# Altium schematic sheet CAN.SchDoc
size A4
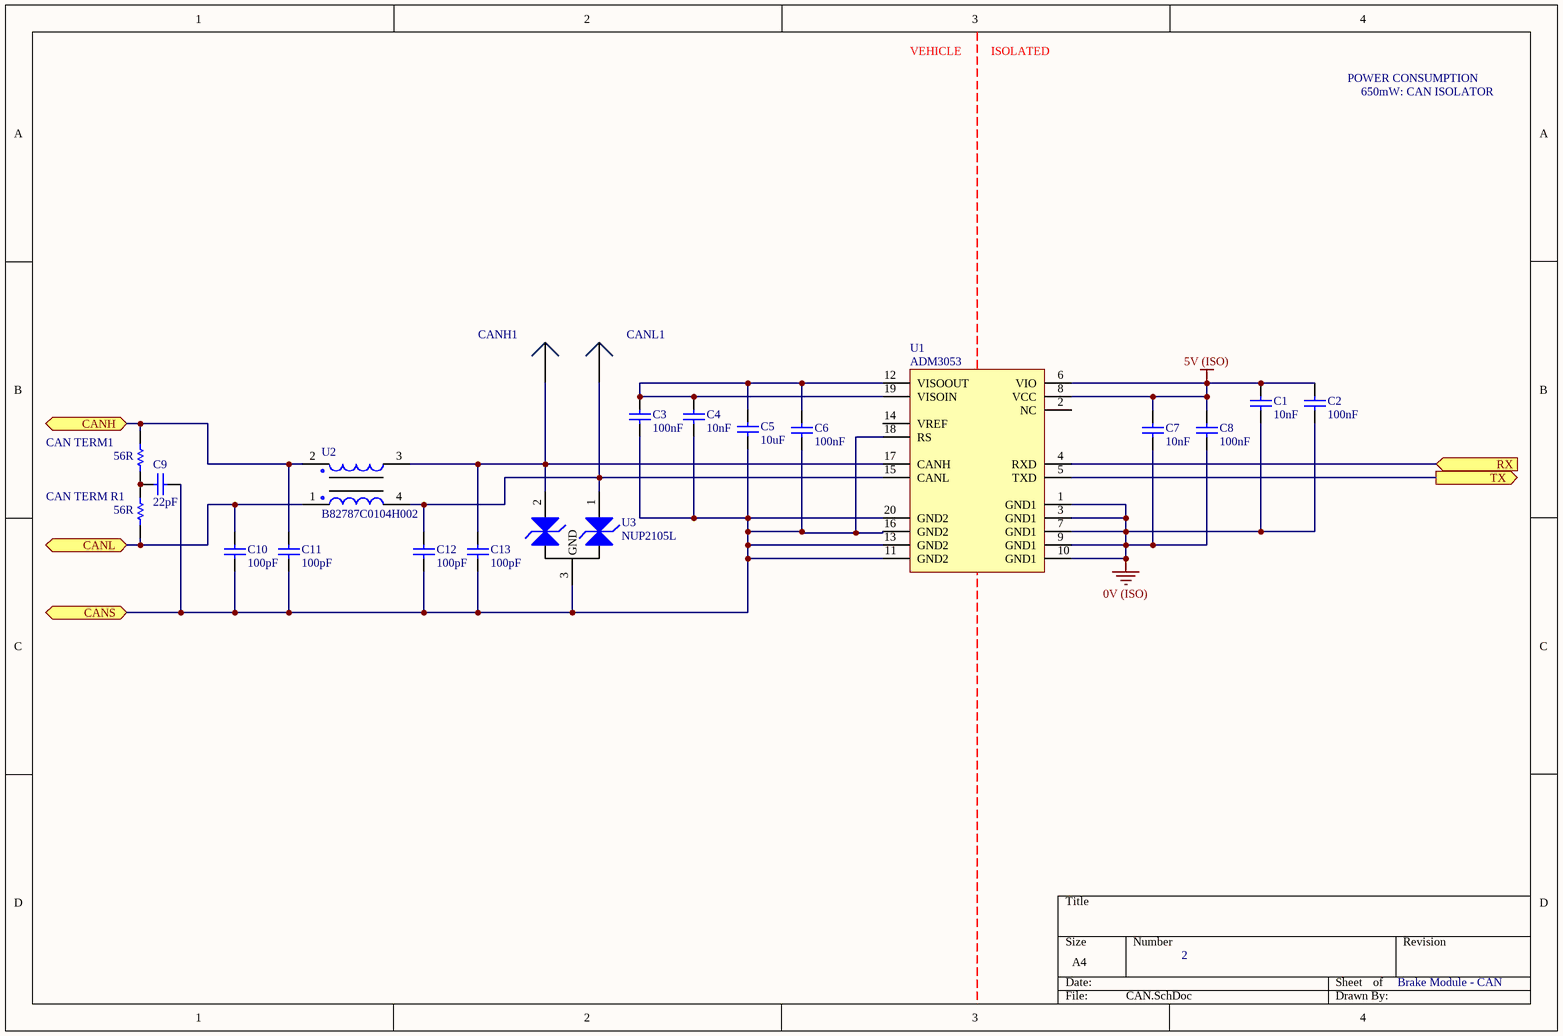
[diagram p0: CAN.SchDoc]

## Parts
C1  10nF  [C0603]
C2  100nF  [C0603]
C3  100nF  [C0603]
C4  10nF  [C0603]
C5  10uF  [C0603]
C6  100nF  [C0603]
C7  10nF  [C0603]
C8  100nF  [C0603]
C9  22pF  [0805]
C10  100pF  [C0603]
C11  100pF  [C0603]
C12  100pF  [C0603]
C13  100pF  [C0603]
CAN_TERM1  56R  [0805]
CAN_TERM_R1  56R  [0805]
CANH1  0mm  [SMD Test Point]  (value not drawn)
CANL1  0mm  [SMD Test Point]  (value not drawn)
U1  ADM3053  [AD SOIC-W 20]
U2  B82787C0104H002  [TDK 4-PC Pad]
U3  NUP2105L  [ON SOT-23]

## Ports
CANH (bidir), CANL (bidir), CANS (bidir), RX (in), TX (out)

## Nets
0V (ISO): C1.1 C2.1 C7.1 C8.1 U1.1(GND1) U1.3(GND1) U1.7(GND1) U1.9(GND1) U1.10(GND1)
5V (ISO): C1.2 C2.2 C7.2 C8.2 U1.6(VIO) U1.8(VCC)
CANH: C11.2 CAN_TERM1.2 U2.2 ; port CANH
CANL: C10.2 CAN_TERM_R1.1 U2.1 ; port CANL
CANS: C3.1 C4.1 C5.1 C6.1 C9.2 C10.1 C11.1 C12.1 C13.1 U1.11(GND2) U1.13(GND2) U1.16(GND2) U1.18(RS) U1.20(GND2) U3.3(GND) ; port CANS
RX: U1.4(RXD) ; port RX
TX: U1.5(TXD) ; port TX
NetC3_2: C3.2 C4.2 C5.2 C6.2 U1.12(VISOOUT) U1.19(VISOIN)
NetC9_1: C9.1 CAN_TERM1.1 CAN_TERM_R1.2
NetC12_2: C12.2 CANL1.1 U1.15(CANL) U2.4 U3.1(CAN_H)
NetC13_2: C13.2 CANH1.1 U1.17(CANH) U2.3 U3.2(CAN_L)

Not connected (* = marked no-connect by the designer): U1 2(NC) 14(VREF)

## Notes on the sheet
- VEHICLE
- ISOLATED
- POWER CONSUMPTION
- 650mW: CAN ISOLATOR
- 2
- Brake Module - CAN

## Library data of the parts
C1 C4 C7 = CC0603JPX7R9BB103: Tolerance: 5%; Material: C0G; Rated Voltage: 50V; Part Number: CC0603JPX7R9BB103; Value: 10nF; Digikey Link: #https://www.digikey.com.au/en/products/detail/yageo/CC0603JPX7R9BB103/11490710#
C2 C3 C6 C8 = CC0603ZPY5V9BB104: Tolerance: 5%; Material: C0G; Rated Voltage: 50V; Part Number: CC0603ZPY5V9BB104; Value: 100nF; Digikey Link: #https://www.digikey.com.au/en/products/detail/yageo/CC0603ZPY5V9BB104/11490657#
C5 = GRM188R6YA106MA73D: Tolerance: 20%; Material: X5R; Rated Voltage: 35V; Part Number: GRM188R6YA106MA73D; Value: 10uF; Digikey Link: #https://www.digikey.com.au/en/products/detail/murata-electronics/GRM188R6YA106MA73D/5877411#
C9 = GRM21A5C2E220JW01D: Manufacturer: muRata; Tolerance: ±5%; Material: C0G, NP0; Rated Voltage: 250V; Part Number: GRM21A5C2E220JW01D; Value: 22pF; Digikey Part Number: 490-5534-1-ND
C10-C13 = CC0603JPNPO9BN101: Tolerance: 5%; Material: C0G; Rated Voltage: 50V; Part Number: CC0603JPNPO9BN101; Value: 100pF; Digikey Link: #https://www.digikey.com.au/en/products/detail/yageo/CC0603JPNPO9BN101/11490847#
CAN_TERM1 CAN_TERM_R1 = RC0805FR0756RL: Manufacturer: YAGEO; Tolerance: 0.01; Rated Voltage: 0.125W; Part Number: RC0805FR0756RL; Value: 56R; Material: FR-07; Digikey Part Number: 311-56.0CRCT-ND
CANH1 CANL1 = SMD Test Point: Positions: 1; Row Spacing: 0; Flange: No; Contact: NA; Part Number: SMD Test Point; Pitch: 0mm; Angle: 0
U1 = ADM3053: Isolated CAN Transceiver; Manufacturer: Analogue Devices; Part Number: ADM3053; Digikey Part Number: ADM3053BRWZ-ND; Digikey Link: https://www.digikey.com/product-detail/en/analog-devices-inc/ADM3053BRWZ/ADM3053BRWZ-ND/2709332
U2 = B82787C0104H002: 100µH @ 100kHz 2 Line Common Mode Choke Surface Mount 5.8 kOhms @ 10MHz 150mA DCR 2Ohm; Manufacturer: EPCOS (TDK); Part Number: B82787C0104H002; Impedence: 5.8 kOhms @ 10MHz; Material: Wirewound; Rated Current: 150mA; Digikey Part Number: 495-4598-1-ND; Digikey Link: https://www.digikey.com/product-detail/en/epcos-tdk/B82787C0104H002/495-4598-2-ND/3680998; Value: 100µH @ 100kHz
U3 = NUP2105L: Dual Line CAN Bus Protector; Manufacturer: ON Semiconductor; Part Number: NUP2105L; Digikey Part Number: NUP2105LT1GOSCT-ND; Digikey Link: https://www.digikey.com/product-detail/en/on-semiconductor/NUP2105LT1G/NUP2105LT1GOSCT-ND/1485001